# EAGLE design PCB-BI16-1x4 (EAGLE 7.5.0)

## Sheet 1 of 2
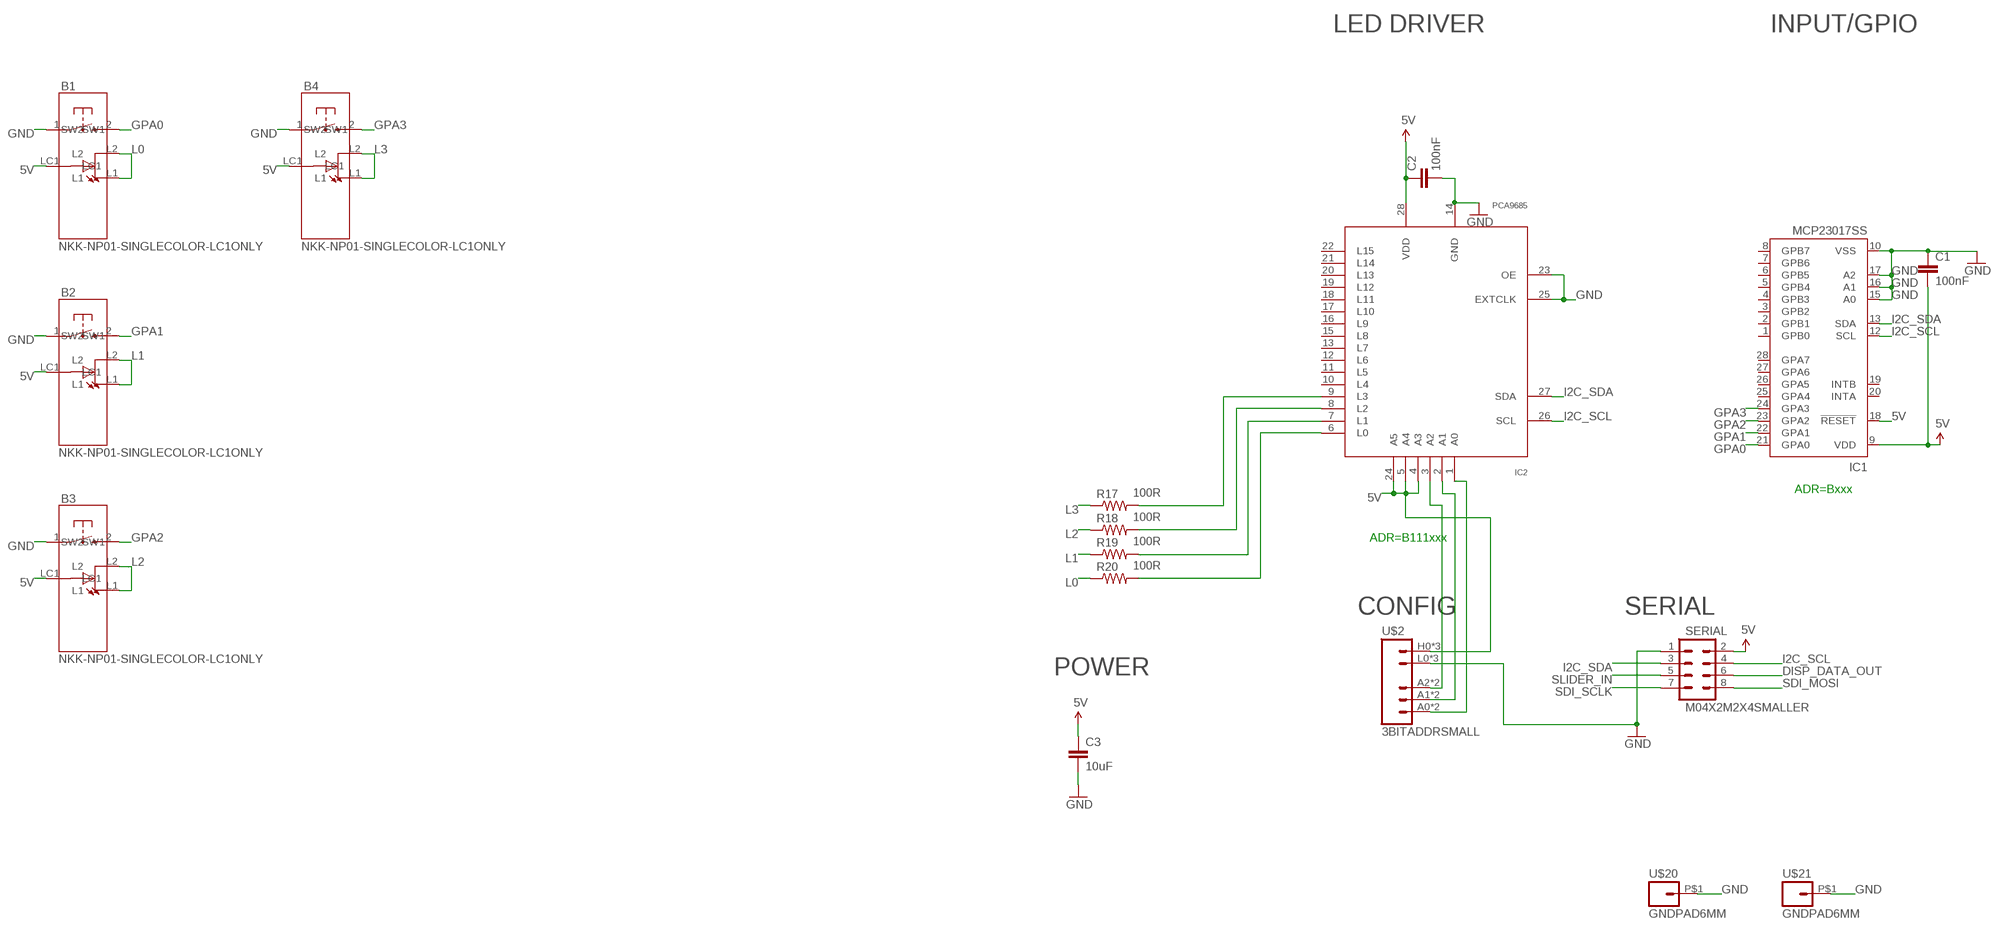
[diagram p0: schematic, sheet 1]

### Parts
B1  NKK-NP01-SINGLECOLOR-LC1ONLY  [NKK-NP01_LESSHOLES2]
B2  NKK-NP01-SINGLECOLOR-LC1ONLY  [NKK-NP01_LESSHOLES2]
B3  NKK-NP01-SINGLECOLOR-LC1ONLY  [NKK-NP01_LESSHOLES2]
B4  NKK-NP01-SINGLECOLOR-LC1ONLY  [NKK-NP01_LESSHOLES2]
C1  100nF  CAP0603-CAP  [0603-CAP]
C2  100nF  CAP0603-CAP  [0603-CAP]
C3  10uF  CAP0805  [0805]
IC1  MCP23017SS  [SSOP28]
IC2  PCA9685  [TSSOP28]
R17  100R  RESISTOR0603-RES  [0603-RES]
R18  100R  RESISTOR0603-RES  [0603-RES]
R19  100R  RESISTOR0603-RES  [0603-RES]
R20  100R  RESISTOR0603-RES  [0603-RES]
SERIAL  M04X2M2X4SMALLER  [M2X4SMALLER]
U$2  3BITADDRSMALL  [3BITADDR_SMALL]
U$20  GNDPAD6MM  [3.2MMPAD6MM]
U$21  GNDPAD6MM  [3.2MMPAD6MM]

### Nets
5V [Power]: B1.LC1 B2.LC1 B3.LC1 B4.LC1 C1.2 C2.1 C3.1 IC1.9(VDD) IC1.18(!RESET) IC2.4(A3) IC2.5(A4) IC2.24(A5) IC2.28(VDD) SERIAL.2 U$2.H0(VCC) U$2.H1(VCC) U$2.H2(VCC)
DISP_DATA_OUT: SERIAL.6
GND [Power]: B1.1(SW1) B2.1(SW1) B3.1(SW1) B4.1(SW1) C1.1 C2.2 C3.2 IC1.10(VSS) IC1.15(A0) IC1.16(A1) IC1.17(A2) IC2.14(GND) IC2.23(OE) IC2.25(EXTCLK) SERIAL.1 U$2.L0(GND) U$2.L1(GND) U$2.L2(GND) U$20.P$1 U$21.P$1
GPA0: B1.2(SW2) IC1.21(GPA0)
GPA1: B2.2(SW2) IC1.22(GPA1)
GPA2: B3.2(SW2) IC1.23(GPA2)
GPA3: B4.2(SW2) IC1.24(GPA3)
I2C_SCL: IC1.12(SCL) IC2.26(SCL) SERIAL.4
I2C_SDA: IC1.13(SDA) IC2.27(SDA) SERIAL.3
L0: B1.L1 B1.L2 R20.1
L1: B2.L1 B2.L2 R19.1
L2: B3.L1 B3.L2 R18.1
L3: B4.L1 B4.L2 R17.1
N$1: IC2.3(A2) U$2.A2 U$2.AS2(A2)
N$2: IC2.2(A1) U$2.A1 U$2.AS1(A1)
N$3: IC2.1(A0) U$2.A0 U$2.AS0(A0)
N$10: IC2.9(L3) R17.2
N$11: IC2.8(L2) R18.2
N$12: IC2.7(L1) R19.2
N$19: IC2.6(L0) R20.2
SDI_MOSI: SERIAL.8
SDI_SCLK: SERIAL.7
SLIDER_IN: SERIAL.5
Unconnected: IC1.1(GPB0) IC1.2(GPB1) IC1.3(GPB2) IC1.4(GPB3) IC1.5(GPB4) IC1.6(GPB5) IC1.7(GPB6) IC1.8(GPB7) IC1.19(INTB) IC1.20(INTA) IC1.25(GPA4) IC1.26(GPA5) IC1.27(GPA6) IC1.28(GPA7) IC2.10(L4) IC2.11(L5) IC2.12(L6) IC2.13(L7) IC2.15(L8) IC2.16(L9) IC2.17(L10) IC2.18(L11) IC2.19(L12) IC2.20(L13) IC2.21(L14) IC2.22(L15)

### Notes on the sheet
- LED DRIVER | INPUT/GPIO
- ADR=Bxxx
- ADR=B111xxx
- CONFIG | SERIAL
- POWER

## Sheet 2 of 2

## Library data of the parts
B1-B4 = SKAARHOJ:NKK-NP01-SINGLECOLOR-LC1ONLY
C1-C3 = SparkFun:CAP: Capacitor Standard 0603 ceramic capacitor, and 0.1" leaded capacitor.
IC1 = microchip:MCP23017: http://ww1.microchip.com/downloads/en/DeviceDoc/21952a.pdf Source: http://ww1.microchip.com/downloads/en/DeviceDoc/21952a.pdf; MF: MICROCHIP; MPN: MCP23017-E/SS; OC_FARNELL: 1467674; OC_NEWARK: 31K2960
IC2 = wsmith:PCA9685
R17-R20 = SparkFun:RESISTOR: Resistor Basic schematic elements and footprints for 0603, 1206, and PTH resistors.
SERIAL = SKAARHOJ:M04X2
U$2 = SKAARHOJ:3BITADDR
U$20 U$21 = SKAARHOJ:GNDPAD

## Net classes
0 default: width 0.203 mm, drill 0.305 mm, clearance 0.152 mm
1 Power: width 0.406 mm, drill 0.61 mm, clearance 0.203 mm

## Board
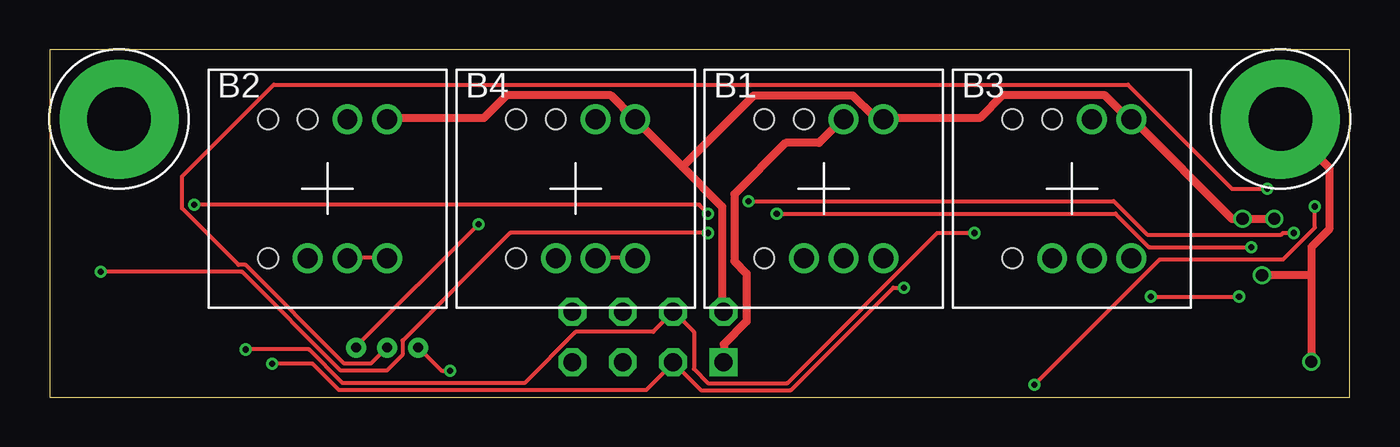
[diagram p1: board, top side]
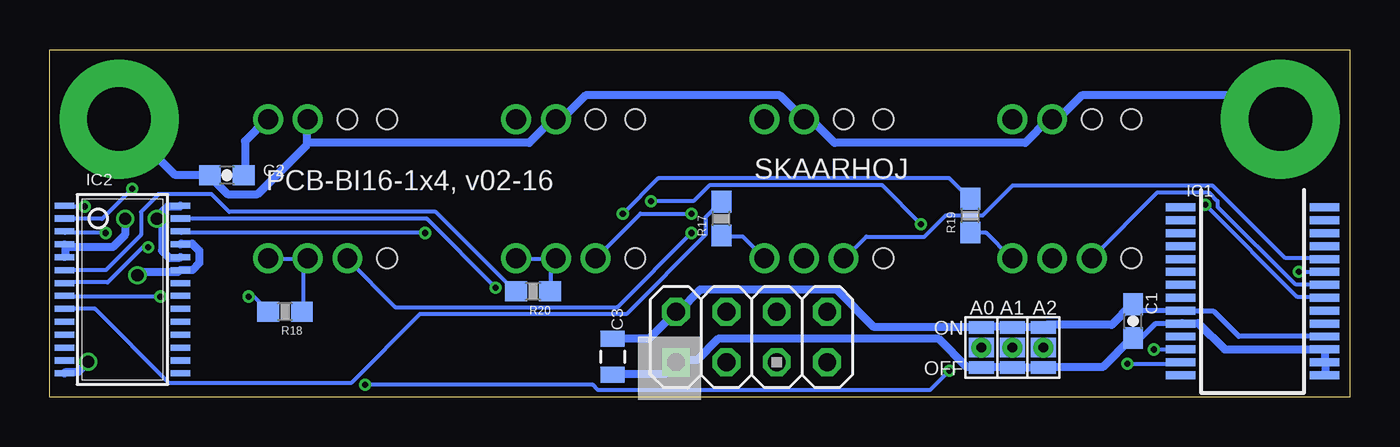
[diagram p2: board, bottom side, seen from below]

Size 65.5 x 17.5 mm. Coordinates in mm from the lower left corner, seen from the top.
Outline: 0,0 65.5,0 65.5,17.5 0,17.5 0,0
Copper layers (1*16): Top 0.035mm / dielectric 1.5mm / Bottom 0.035mm
Design rules "Fusion_eagle_rule_v1.1": minimum track width 6mil, minimum drill 12mil, track to track 6mil, track to pad 6mil, pad to pad 6mil, via to via 6mil, smd to smd 0mil, copper to edge 10mil, drill to drill 10mil, minimum pad ring 10mil, minimum via ring 6mil, stop-mask expansion 2mil, vias tented up to drill 100mil, thermal gap 10mil

### Footprints (pad centres in the part's own frame; a part is rotated, then mirrored left to right if it is on the bottom)
NKK-NP01_LESSHOLES2 = drill 1: 1 1,3.5; 2 -1,-3.5; L1 3,-3.5; L2 1,-3.5; LC1 3,3.5 | hole 1: -3,3.5; -3,-3.5; -1,3.5
0603-CAP = smd 1.1 x 1: 1 -0.85,0; 2 0.85,0
0805 = smd 0.8 x 1.2: 1 -0.9,0; 2 0.9,0
SSOP28 = smd 0.4 x 1.5: 1 -4.225,-3.625; 2 -3.575,-3.625; 3 -2.925,-3.625; 4 -2.275,-3.625; 5 -1.625,-3.625; 6 -0.975,-3.625; 7 -0.325,-3.625; 8 0.325,-3.625; 9 0.975,-3.625; 10 1.625,-3.625; 11 2.275,-3.625; 12 2.925,-3.625; 13 3.575,-3.625; 14 4.225,-3.625; 15 4.225,3.625; 16 3.575,3.625; 17 2.925,3.625; 18 2.275,3.625; 19 1.625,3.625; 20 0.975,3.625; 21 0.325,3.625; 22 -0.325,3.625; 23 -0.975,3.625; 24 -1.625,3.625; 25 -2.275,3.625; 26 -2.925,3.625; 27 -3.575,3.625; 28 -4.225,3.625
TSSOP28 = smd 0.305 x 0.991: 1 -4.225,-2.918; 2 -3.575,-2.918; 3 -2.925,-2.918; 4 -2.275,-2.918; 5 -1.625,-2.918; 6 -0.975,-2.918; 7 -0.325,-2.918; 8 0.325,-2.918; 9 0.975,-2.918; 10 1.625,-2.918; 11 2.275,-2.918; 12 2.925,-2.918; 13 3.575,-2.918; 14 4.225,-2.918; 15 4.225,2.918; 16 3.575,2.918; 17 2.925,2.918; 18 2.275,2.918; 19 1.625,2.918; 20 0.975,2.918; 21 0.325,2.918; 22 -0.325,2.918; 23 -0.975,2.918; 24 -1.625,2.918; 25 -2.275,2.918; 26 -2.925,2.918; 27 -3.575,2.918; 28 -4.225,2.918
0603-RES = smd 1.1 x 1: 1 -0.85,0; 2 0.85,0
M2X4SMALLER = drill 0.9 square: 1 -1.27,3.81 | drill 0.9 octagon: 2 1.27,3.81; 3 -1.27,1.27; 4 1.27,1.27; 5 -1.27,-1.27; 6 1.27,-1.27; 7 -1.27,-3.81; 8 1.27,-3.81
3BITADDR_SMALL = drill 0.5: A0 -1.565,0; A1 0,0; A2 1.565,0 | smd 1.27 x 1: AS0 -1.565,0; AS1 0,0; AS2 1.565,0 | smd 1.27 x 0.635: H0 -1.565,1; H1 0,1; H2 1.565,1; L0 -1.565,-1; L1 0,-1; L2 1.565,-1
3.2MMPAD6MM = drill 3.2 pad 6: P$1 0,0

### Placement (x,y rotation side)
B1  39,10.5 0 top
B2  14,10.5 0 top
B3  51.5,10.5 0 top
B4  26.5,10.5 0 top
C1  10.92,3.83 90 bottom
C2  56.58,11.18 180 bottom
C3  37.14,2.03 270 bottom
IC1  4.9,5.33 270 bottom
IC2  61.83,5.42 270 bottom
R17  31.66,8.99 90 bottom
R18  53.65,4.31 180 bottom
R19  19.12,9.14 90 bottom
R20  41.15,5.33 180 bottom
SERIAL  30.14,3.03 90 bottom
U$2  17,2.5 0 bottom
U$20  3.5,14 0 top
U$21  62,14 0 top

### Tracks (layer width: path | path; a pad name or v marks a point on that pad's centre or on a via)
5V  (via drill 0.61)
  Top 0.406: v61.7,8.98 v60.1,8.98 59.56,8.98 54.59,13.96 B3.LC1 54.32,14.05 53.16,15.2 48.01,15.2 46.85,14.05 42.05,14.05 B1.LC1 41.87,14.13 41.52,14.13 40.45,15.2 35.47,15.2 31.87,11.6 | B2.LC1 17.07,14.05 21.87,14.05 23.02,15.2 28.27,15.2 29.43,14.05 B4.LC1 29.6,13.87 31.87,11.6 | 31.87,11.6 33.87,9.6 33.87,4.36 SERIAL.2
  Bottom 0.254: C1.2 10.6,4.36 IC1.9 8.49,4.32 6.86,4.32 5.6,3.06 IC1.18
  Bottom 0.406: 59.83,8.98 59.83,9.34 59.56,9.6 58.94,9.6 IC2.28 | 59.83,8.98 59.83,7.38 59.47,7.02 58.94,7.02 IC2.24 | IC2.5 64.72,7.11 64.72,7.64 IC2.4 64.54,7.56 62.32,7.56 61.7,8.18 v61.7,8.98 | C2.1 55.65,11.2 55.65,12.89 54.59,13.96 B3.LC1 | v60.1,8.98 59.83,8.98 | C1.2 11.02,4.62 12,3.65 15.29,3.65 U$2.H2 15.47,3.56 16.98,3.56 U$2.H1 17.16,3.56 18.49,3.56 U$2.H0 18.76,3.56 24,3.56 25.87,5.42 32.72,5.42 33.78,4.36 SERIAL.2 33.96,4.27 35.29,2.93 37.07,2.93 C3.1
GND  (via drill 0.61)
  Top 0.406: 63.56,6.13 63.56,7.56 64.45,8.45 64.45,11.56 62.05,13.96 U$21.P$1 | 63.56,6.13 v63.56,1.78 | 63.56,6.13 v61.07,6.13 | SERIAL.1 33.96,1.78 33.96,2.67 35.12,3.82 35.12,6.22 34.49,6.84 34.49,10.22 37.07,12.8 38.76,12.8 39.92,13.96 B1.1
  Bottom 0.254: IC1.10 9.79,3.71 10.5,3 10.89,3 C1.1
  Bottom 0.406: IC2.25 58.85,7.73 58.32,7.73 57.96,7.38 57.96,6.76 58.32,6.4 58.85,6.4 IC2.23 59.03,6.31 60.9,6.31 v61.07,6.13 | v63.56,1.78 64.1,1.25 64.72,1.25 IC2.14 | U$21.P$1 61.96,13.96 59.21,11.2 57.43,11.2 C2.2 57.34,11.02 56.54,10.22 55.03,10.22 52.54,12.71 52.54,12.8 | 52.54,12.8 52.54,13.96 B3.1 | C3.2 37.07,1.16 34.49,1.16 33.96,1.69 SERIAL.1 33.78,1.87 32.89,1.87 31.83,2.93 20.71,2.93 19.29,1.51 18.76,1.51 U$2.L0 18.49,1.51 17.16,1.51 U$2.L1 16.98,1.51 15.47,1.51 U$2.L2 15.29,1.51 12.45,1.51 11.02,2.93 C1.1 | IC1.15 1.25,1.16 1.25,1.69 IC1.16 1.25,1.96 1.25,2.4 IC1.17 1.42,2.4 6.31,2.4 7.64,3.73 8.45,3.73 IC1.10 | U$20.P$1 3.56,14.05 4.71,15.2 13.51,15.2 14.67,14.05 14.94,14.05 B2.1 15.2,13.96 16.36,12.8 25.96,12.8 27.11,13.96 27.47,13.96 B4.1 27.65,14.13 28.71,15.2 38.49,15.2 39.65,14.05 39.92,14.05 B1.1 40.18,13.96 41.34,12.8 52.54,12.8
GPA0  (via drill 0.3)
  Top 0.203: v7.29,9.69 32.72,9.69 v33.16,9.25
  Bottom 0.203: v7.29,9.69 2.67,5.07 1.33,5.07 IC1.21 | v33.16,9.25 35.74,9.25 37.96,7.02 B1.2
GPA1
  Bottom 0.203: IC1.22 1.33,5.69 2.76,5.69 6.67,9.6 6.67,9.87 7.11,10.31 9.69,10.31 12.98,7.02 B2.2
GPA2  (via drill 0.3)
  Top 0.203: v2.58,6.31 9.69,6.31 14.67,1.33 16.98,1.33 17.78,2.13 17.78,2.85 23.2,8.27 v33.16,8.27
  Bottom 0.203: v2.58,6.31 1.33,6.31 IC1.23 | v33.16,8.27 36.89,4.53 48.09,4.53 50.49,6.93 B3.2
GPA3
  Bottom 0.203: IC1.24 1.33,7.02 3.29,7.02 6.93,10.67 16.98,10.67 18.49,9.16 20.36,9.16 21.43,8.09 24.36,8.09 25.43,7.02 B4.2
I2C_SCL  (via drill 0.3)
  Top 0.203: v46.58,8.27 44.72,8.27 37.16,0.71 33.16,0.71 32.45,1.42 32.45,3.29 31.47,4.27 SERIAL.4 31.38,4.27 30.4,3.29 26.49,3.29 23.91,0.71 14.76,0.71 13.07,2.4 v9.87,2.4
  Bottom 0.203: v46.58,8.27 58.85,8.27 IC2.26 | v9.87,2.4 IC1.12
I2C_SDA  (via drill 0.3)
  Top 0.203: v43.03,5.51 42.49,5.51 37.34,0.36 32.8,0.36 31.47,1.69 SERIAL.3 31.38,1.69 30.05,0.36 14.58,0.36 13.25,1.69 v11.2,1.69
  Bottom 0.203: v43.03,5.51 46.49,8.98 58.85,8.98 IC2.27 | v11.2,1.69 8.53,1.69 IC1.13
L0
  Bottom 0.203: R20.1 40.27,5.33 40.27,6.67 40.01,6.93 B1.L2 40.36,6.67 40.63,6.93 41.96,6.93 B1.L1
L1
  Top 0.203: B2.L2 15.02,7.02 16.98,7.02 B2.L1
  Bottom 0.203: R19.1 19.11,8.27 18.31,8.27 17.07,7.02 B2.L1
L2
  Bottom 0.203: R18.1 52.72,4.36 52.72,6.76 52.54,6.93 B3.L2 52.81,6.76 52.98,6.93 54.5,6.93 B3.L1
L3
  Top 0.203: B4.L2 27.56,7.02 29.43,7.02 B4.L1
  Bottom 0.203: R17.1 31.65,8.09 30.58,8.09 29.52,7.02 B4.L1
N$1  (via drill 0.3)
  Top 0.203: v62.67,8.27 62.14,8.27 62.05,8.18 55.3,8.18 53.61,9.87 v35.2,9.87 | v21.6,8.71 15.47,2.58 U$2.A2
  Bottom 0.203: v62.67,8.27 64.72,8.27 IC2.3 | v35.2,9.87 33.07,9.87 32.27,10.67 23.56,10.67 v21.6,8.71 | 15.47,2.49 U$2.A2
N$2  (via drill 0.3)
  Top 0.203: v61.34,10.49 59.56,10.49 54.32,15.73 11.29,15.73 6.67,11.11 6.67,9.51 9.51,6.67 9.87,6.67 14.85,1.69 16.18,1.69 16.98,2.49 U$2.A1
  Bottom 0.203: v61.34,10.49 62.85,8.98 64.72,8.98 IC2.2 | 17.07,2.49 U$2.A1
N$3  (via drill 0.3)
  Top 0.203: v63.74,9.6 63.74,8.53 62.14,6.93 55.92,6.93 v49.61,0.62 | v20.18,1.33 19.74,1.33 18.58,2.49 U$2.A0
  Bottom 0.203: v63.74,9.6 64.72,9.6 IC2.1 | v49.61,0.62 38.14,0.62 37.87,0.36 21.16,0.36 v20.18,1.33 | 18.58,2.49 U$2.A0
N$10
  Bottom 0.203: IC2.9 64.72,4.45 63.21,4.45 59.47,0.71 50.32,0.71 46.85,4.18 36.45,4.18 32.45,8.18 32.45,9.07 31.74,9.78 R17.2
N$11  (via drill 0.3)
  Top 0.203: v55.47,5.07 v59.92,5.07
  Bottom 0.203: v59.92,5.07 64.72,5.07 IC2.8 | v55.47,5.07 55.21,5.07 54.5,4.36 R18.2
N$12  (via drill 0.3)
  Top 0.203: v60.54,7.56 55.38,7.56 53.7,9.25 v36.63,9.25
  Bottom 0.203: v60.54,7.56 60.81,7.56 62.59,5.78 64.72,5.78 IC2.7 | v36.63,9.25 34.85,11.02 20.18,11.02 19.2,10.05 R19.2
N$19
  Bottom 0.203: IC2.6 64.72,6.4 62.67,6.4 60.9,8.18 60.9,9.34 60.01,10.22 57.34,10.22 56.45,9.34 46.05,9.34 42.05,5.33 R20.2

### Text on the board
_bsilk: SKAARHOJ | PCB-BI16-1x4, v02-16